# EAGLE schematic Diagram (EAGLE 8.6.0)
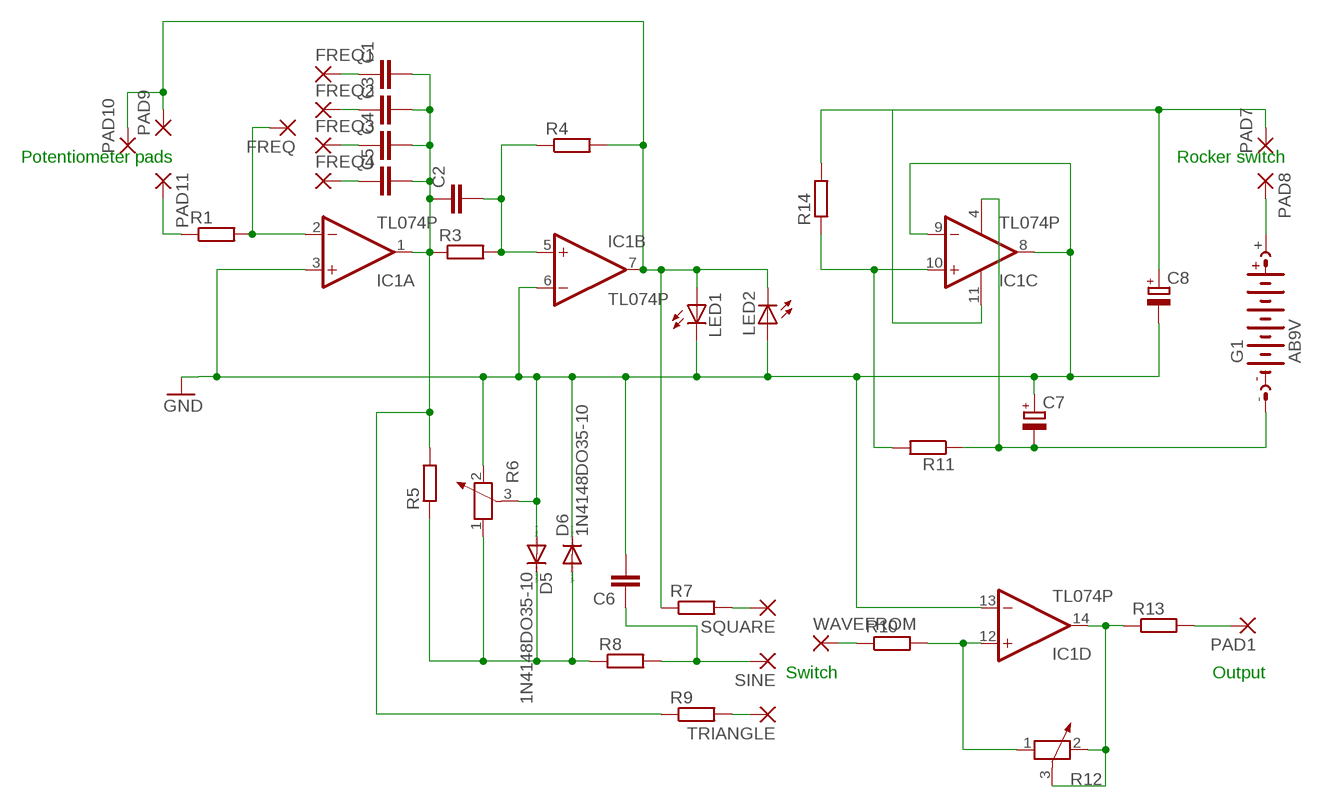
[diagram p0: schematic, sheet 1]

## Parts
C1  C-EU050-025X075  [C050-025X075]
C2  C-EU050-025X075  [C050-025X075]
C3  C-EU050-025X075  [C050-025X075]
C4  C-EU050-025X075  [C050-025X075]
C5  C-EU050-025X075  [C050-025X075]
C6  C-EU050-025X075  [C050-025X075]
C7  CPOL-EUE5-5  [E5-5]
C8  CPOL-EUE5-5  [E5-5]
D5  1N4148DO35-10  [DO35-10]
D6  1N4148DO35-10  [DO35-10]
FREQ  2,54/1,0  [2,54/1,0]
FREQ1  2,54/1,0  [2,54/1,0]
FREQ2  2,54/1,0  [2,54/1,0]
FREQ3  2,54/1,0  [2,54/1,0]
FREQ4  2,54/1,0  [2,54/1,0]
G1  AB9V  [AB9V]
IC1  TL074P  [DIL14]
LED1  LED5MM  [LED5MM]
LED2  LED5MM  [LED5MM]
PAD1  2,54/1,0  [2,54/1,0]
PAD7  2,54/1,0  [2,54/1,0]
PAD8  2,54/1,0  [2,54/1,0]
PAD9  2,54/1,0  [2,54/1,0]
PAD10  2,54/1,0  [2,54/1,0]
PAD11  2,54/1,0  [2,54/1,0]
R1  R-EU_0207/10  [0207/10]
R3  R-EU_0207/10  [0207/10]
R4  R-EU_0207/10  [0207/10]
R5  R-EU_0207/10  [0207/10]
R6  POTENTIOMETER_PT-10  [PT-10]
R7  R-EU_0207/10  [0207/10]
R8  R-EU_0207/10  [0207/10]
R9  R-EU_0207/10  [0207/10]
R10  R-EU_0207/10  [0207/10]
R11  R-EU_0207/10  [0207/10]
R12  POTENTIOMETER_PT-10  [PT-10]
R13  R-EU_0207/10  [0207/10]
R14  R-EU_0207/10  [0207/10]
SINE  2,54/1,0  [2,54/1,0]
SQUARE  2,54/1,0  [2,54/1,0]
TRIANGLE  2,54/1,0  [2,54/1,0]
WAVEFROM  2,54/1,0  [2,54/1,0]

## Nets
N$1: C1.2 C2.1 C3.2 C4.2 C5.2 IC1.1(A:OUT) R3.1 R5.2 R9.1
N$2: C2.2 IC1.5(B:+IN) R3.2 R4.1
N$3: IC1.7(B:OUT) LED1.A LED2.K(C) PAD9.1(P) PAD10.1(P) R4.2 R7.1
N$4: C7.- G1.- IC1.4(P:V+) R11.1
N$5: C1.1 FREQ1.1(P)
N$6: IC1.10(C:+IN) R11.2 R14.1
N$7: IC1.14(D:OUT) R12.2 R12.3 R13.1
N$8: C8.+ IC1.11(P:V-) PAD7.1(P) R14.2
N$9: IC1.12(D:+IN) R10.2 R12.1
N$10: PAD11.1(P) R1.1
N$11: D5.C D6.A R5.1 R6.1 R8.1
N$12: R10.1 WAVEFROM.1(P)
N$13: R7.2 SQUARE.1(P)
N$14: C6.1 R8.2 SINE.1(P)
N$15: PAD1.1(P) R13.2
N$16: R9.2 TRIANGLE.1(P)
N$17: G1.+ PAD8.1(P)
N$18: C3.1 FREQ2.1(P)
N$19: C6.2 C7.+ C8.- D5.A D6.C IC1.3(A:+IN) IC1.6(B:-IN) IC1.8(C:OUT) IC1.9(C:-IN) IC1.13(D:-IN) LED1.K(C) LED2.A R6.2 R6.3
N$20: C4.1 FREQ3.1(P)
N$21: C5.1 FREQ4.1(P)
N$23: FREQ.1(P) IC1.2(A:-IN) R1.2

## Notes on the sheet
- Potentiometer pads | Rocker switch
- Switch | Output

## Library data of the parts
C1-C6 = resistor:C-EU: CAPACITOR, European symbol
C7 C8 = rcl:CPOL-EU: POLARIZED CAPACITOR, European symbol; SPICEPREFIX: C
D5 D6 = diode:1N4148: DIODE high speed (Philips)
FREQ FREQ1-FREQ4 PAD1 PAD7-PAD11 SINE SQUARE TRIANGLE WAVEFROM = wirepad:2,54/1,0: THROUGH-HOLE PAD
G1 = battery:AB9V: 9-V BATTERY CLIP
IC1 = linear:TL074: OP AMP; SPICEPREFIX: J
LED1 LED2 = led:LED: LED OSRAM: - CHIPLED LG R971, LG N971, LY N971, LG Q971, LY Q971, LO R971, LY R971 LH N974, LH R974 LS Q976, LO Q976, LY Q976 LO Q996 - Hyper CHIPLED LW Q18S LB Q993, LB Q99A, LB R99A - SideLED LS A670, LO A670, LY A670, LG A670, LP A670 LB A673, LV A673, LT A673, LW A673 LH A674 LY A675 LS A676, LA A676, LO A676, LY A676, LW A676 LS A679, LY A679, LG A679 - Hyper Micro SIDELED® LS Y876, LA Y876, LO Y876, LY Y876 LT Y87S - SmartLED LW L88C, LW L88S LB L89C, LB L89S, LG L890 LS L89K, LO L89K, LY L89K LS L896, LA L896, LO L896, LY L896 - TOPLED LS T670, LO T670, LY T670, LG T670, LP T670 LSG T670, LSP T670, LSY T670, LOP T670, LYG T670 LG T671, LOG T671, LSG T671 LB T673, LV T673, LT T673, LW T673 LH T674 LS T676, LA T676, LO T676, LY T676, LB T676, LH T676, LSB T676, LW T676 LB T67C, LV T67C, LT T67C, LS T67K, LO T67K, LY T67K, LW E67C LS E67B, LA E67B, LO E67B, LY E67B, LB E67C, LV E67C, LT E67C LW T67C LS T679, LY T679, LG T679 LS T770, LO T770, LY T770, LG T770, LP T770 LB T773, LV T773, LT T773, LW T773 LH T774 LS E675, LA E675, LY E675, LS T675 LS T776, LA T776, LO T776, LY T776, LB T776 LHGB T686 LT T68C, LB T68C - Hyper Mini TOPLED® LB M676 - Mini TOPLED Santana® LG M470 LS M47K, LO M47K, LY M47K Source: http://www.osram.convergy.de LUXEON: - LUMILED® LXK2-PW12-R00, LXK2-PW12-S00, LXK2-PW14-U00, LXK2-PW14-V00 LXK2-PM12-R00, LXK2-PM12-S00, LXK2-PM14-U00 LXK2-PE12-Q00, LXK2-PE12-R00, LXK2-PE12-S00, LXK2-PE14-T00, LXK2-PE14-U00 LXK2-PB12-K00, LXK2-PB12-L00, LXK2-PB12-M00, LXK2-PB14-N00, LXK2-PB14-P00, LXK2-PB14-Q00 LXK2-PR12-L00, LXK2-PR12-M00, LXK2-PR14-Q00, LXK2-PR14-R00 LXK2-PD12-Q00, LXK2-PD12-R00, LXK2-PD12-S00 LXK2-PH12-R00, LXK2-PH12-S00 LXK2-PL12-P00, LXK2-PL12-Q00, LXK2-PL12-R00 Source: www.luxeon.com KINGBRIGHT: KA-3528ASYC Source: www.kingbright.com
R1 R3-R5 R7-R11 R13 R14 = resistor:R-EU_: RESISTOR, European symbol
R6 R12 = rcl:POTENTIOMETER_: Potentiometer; SPICEMODEL: POT; SPICEPREFIX: X